# Altium schematic sheet Interface.SchDoc: Top Level
size A3; CompanyName: NOT USED; DocumentNumber: 3; SheetNumber: 3; SheetTotal: 5; PageSetup: Record=PageOptions|CenterHorizontal=True|CenterVertical=True|PrintScale=1.00|XCorrection=1.00|YCorrection=1.00|PrintKind=0|BorderSize=5000000|LeftOffset=0|BottomOffset=0|Orientation=2|PaperLength=1000|PaperWidth=1000|Scale=100|PaperSource=7|PrintQuality=-4|MediaType=1|DitherType=10|PaperKind=A3|PrintScaleMode=0
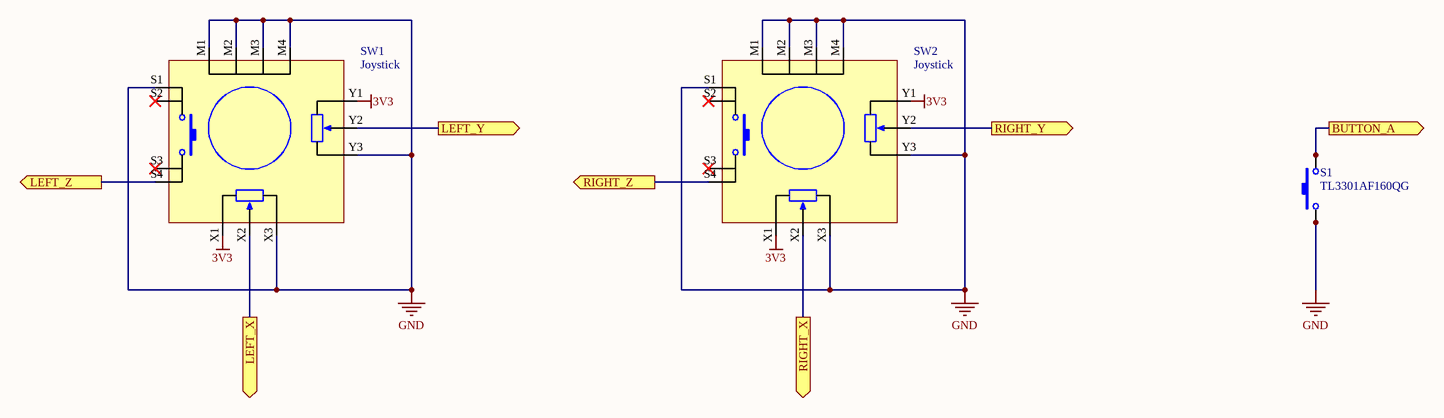
[diagram p0: Interface.SchDoc]

## Parts
S1  TL3301AF160QG  [SW_TL3301AFXXXXG]
SW1  Joystick  [Joystick]
SW2  Joystick  [Joystick]

## Ports
BUTTON_A (out), LEFT_X (out), LEFT_Y (out), LEFT_Z (out), RIGHT_X (out), RIGHT_Y (out), RIGHT_Z (out)

## Nets
3V3: SW1.X1 SW1.Y1 SW2.X1 SW2.Y1
GND: S1.1 S1.2 SW1.M1 SW1.M2 SW1.M3 SW1.M4 SW1.S1 SW1.X3 SW1.Y3 SW2.M1 SW2.M2 SW2.M3 SW2.M4 SW2.S1 SW2.X3 SW2.Y3
BUTTON_A: S1.3 S1.4 ; port BUTTON_A
LEFT_X: SW1.X2 ; port LEFT_X
LEFT_Y: SW1.Y2 ; port LEFT_Y
LEFT_Z: SW1.S4 ; port LEFT_Z
RIGHT_X: SW2.X2 ; port RIGHT_X
RIGHT_Y: SW2.Y2 ; port RIGHT_Y
RIGHT_Z: SW2.S4 ; port RIGHT_Z

Not connected (* = marked no-connect by the designer): SW1 S2* S3*; SW2 S2* S3*

## Notes on the sheet
- Project
- Size:
- Date:
- A3
- Revision:
- Sheet
- of
- Lambo
- File:

## Library data of the parts
S1 = SWT-10009-A: SWITCH TACT 160GF H=5.0MM SMT; Manufacturer: E-Switch; Circuit: SPST-NO; Function: Off-Mom; Display_Name: TL3301AF160QG; Type: Tactile; BWA PN: SWT-10009-A; Schematic Symbol: SW_SPST_2; Manufacturer Part Number: TL3301AF160QG; Supplier 1: Digi-Key; Supplier Part Number 1: EG2526CT-ND